# Altium schematic sheet sensors.SchDoc: Robot Control PCB
size A4; Revision: 0.1; SheetNumber: 4; SheetTotal: 5; DrawnBy: OYSM; ProjectNumber: 1; DocumentSize: A4; PCAName: robot_control_pcb
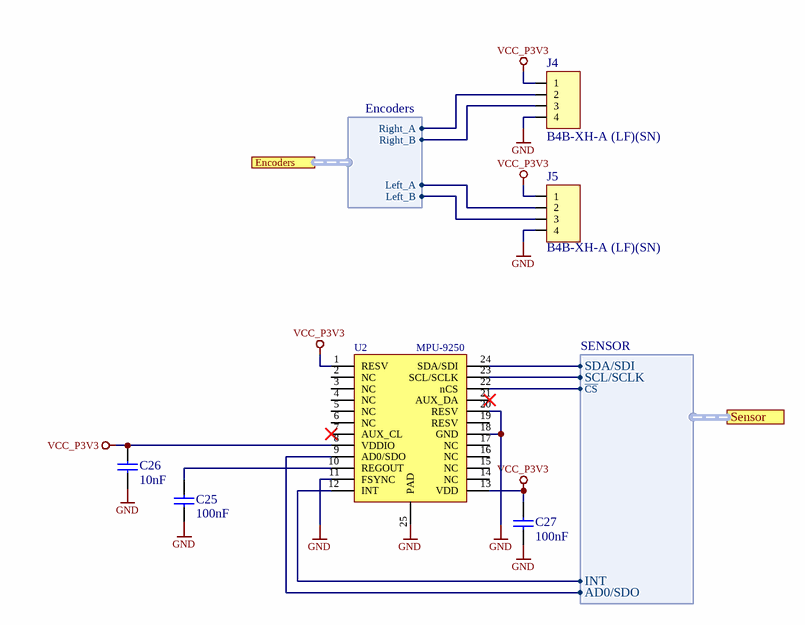
[diagram p0: sensors.SchDoc]

## Parts
C25  100nF  [CAPC1005X04L]
C26  10nF  [CAPC1005X04L]
C27  100nF  [CAPC1005X04L]
J4  B4B-XH-A (LF)(SN)  [JST_4P]
J5  B4B-XH-A (LF)(SN)  [JST_4P]
U2  MPU-9250  [QFN05P40X40X02-24]

## Ports
Encoders (harness Encoders), Sensor (harness SENSOR)

## Harnesses
SENSOR: SDA/SDI, SCL/SCLK, ~{CS}, INT, AD0/SDO
Encoders: Right_A, Right_B, Left_A, Left_B

## Nets
GND: C25.2 C26.1 C27.2 J4.4 J5.4 U2.11(FSYNC) U2.18(GND) U2.20(RESV) U2.25(PAD)
VCC_P3V3: C26.2 C27.1 J4.1 J5.1 U2.1(RESV) U2.8(VDDIO) U2.13(VDD)
NetC25_1: C25.1 U2.10(REGOUT)
NetJ4_2: J4.2 ; port Encoders.Right_A
NetJ4_3: J4.3 ; port Encoders.Right_B
NetJ5_2: J5.2 ; port Encoders.Left_A
NetJ5_3: J5.3 ; port Encoders.Left_B
NetU2_9: U2.9(AD0/SDO) ; port Sensor.AD0/SDO
NetU2_12: U2.12(INT) ; port Sensor.INT
NetU2_22: U2.22(nCS) ; port Sensor.~{CS}
NetU2_23: U2.23(SCL/SCLK) ; port Sensor.SCL/SCLK
NetU2_24: U2.24(SDA/SDI) ; port Sensor.SDA/SDI

Not connected (* = marked no-connect by the designer): U2 2(NC) 3(NC) 4(NC) 5(NC) 6(NC) 7(AUX_CL)* 14(NC) 15(NC) 16(NC) 17(NC) 19(RESV) 21(AUX_DA)*

## Notes on the sheet
- Title
- Size
- Date:
- A4
- Project Number
- Sheet         of
- Revision
- File:
- Drawn By:

## Library data of the parts
C25 C27 = C0402-100n: Capacitor, X7R, ±10%; Note: 16V; Artikkelnr Noca: 20039200; Artikkelnr Simpro: N.A.; Part Number: C0402-100n; Manufacturer: *; Manufacturer Part Number: *; Datasheet: *; LatestRevisionDate: 2009-11-23; Pin Count: 2; Publisher: Nordic Semiconductor; Published: 2009-05-08; Value: 100nF; Supplier: *; Supplier part number: *; 2nd source Supplier: *; 2nd source part number: *; Footprint Doc: 0402
C26 = C0402-10n: Capacitor, X7R, ±10%; Part number IPS: 00000007784; Note: 16V; Artikkelnr Noca: 20039166; Part Number: C0402-10n; Manufacturer: *; Manufacturer Part Number: *; ComponentLink1URL: *; ComponentLink1Description: Datasheet; ComponentLink2URL: *; ComponentLink2Description: Supplier link; HelpURL: *; Footprint Doc: 0402; LatestRevisionDate: 2009-11-23; Pin Count: 2; Publisher: Nordic Semiconductor; Published: 2009-05-08; Value: 10nF; Supplier 1: *; Supplier Part Number 1: *; Supplier 2: *; Supplier Part Number 2: *
J4 J5 = 3046: id: 3046; rad: 3; rom: OV; lager_type: Fremlager; dybde: 0; hylle: 6; antall: 100; pakke_opprettet_av: 815; beskrivelse: JST 4pin (pris pr. stk.); leverandor_varenr: 1516278; pris: 2; nokkelord: Connector, Kontakt; produsent: JST; leverandor: Farnell; pakketype: TH; komponenttype: 11; pakke_opprettet: 28.06.2014 18:25:23; symbol_opprettet_av: 815; symbol_opprettet: 28.06.2014 15:33:28; navn: B4B-XH-A (LF)(SN)
U2 = 5302: =beskrivelse; rad: 4; rom: OV; lager_type: Fremlager; dybde: 0; hylle: 2; antall: 40; pakke_opprettet_av: 815; nokkelord: Narrow Band Multi-Channel RF Transceiver Module; pakketype: QFN; produsent: InvenSense; id: 5302; beskrivelse: MotionTracking device; komponenttype: 6; navn: MPU-9250; kolonne: 4; pakke_opprettet: 22.01.2016 16:18:46; symbol_opprettet_av: 815; symbol_opprettet: 22.01.2016 16:19:50; pris: 0